# EAGLE design I-GAUGE 5V_Rev2 (EAGLE 6.5.0)
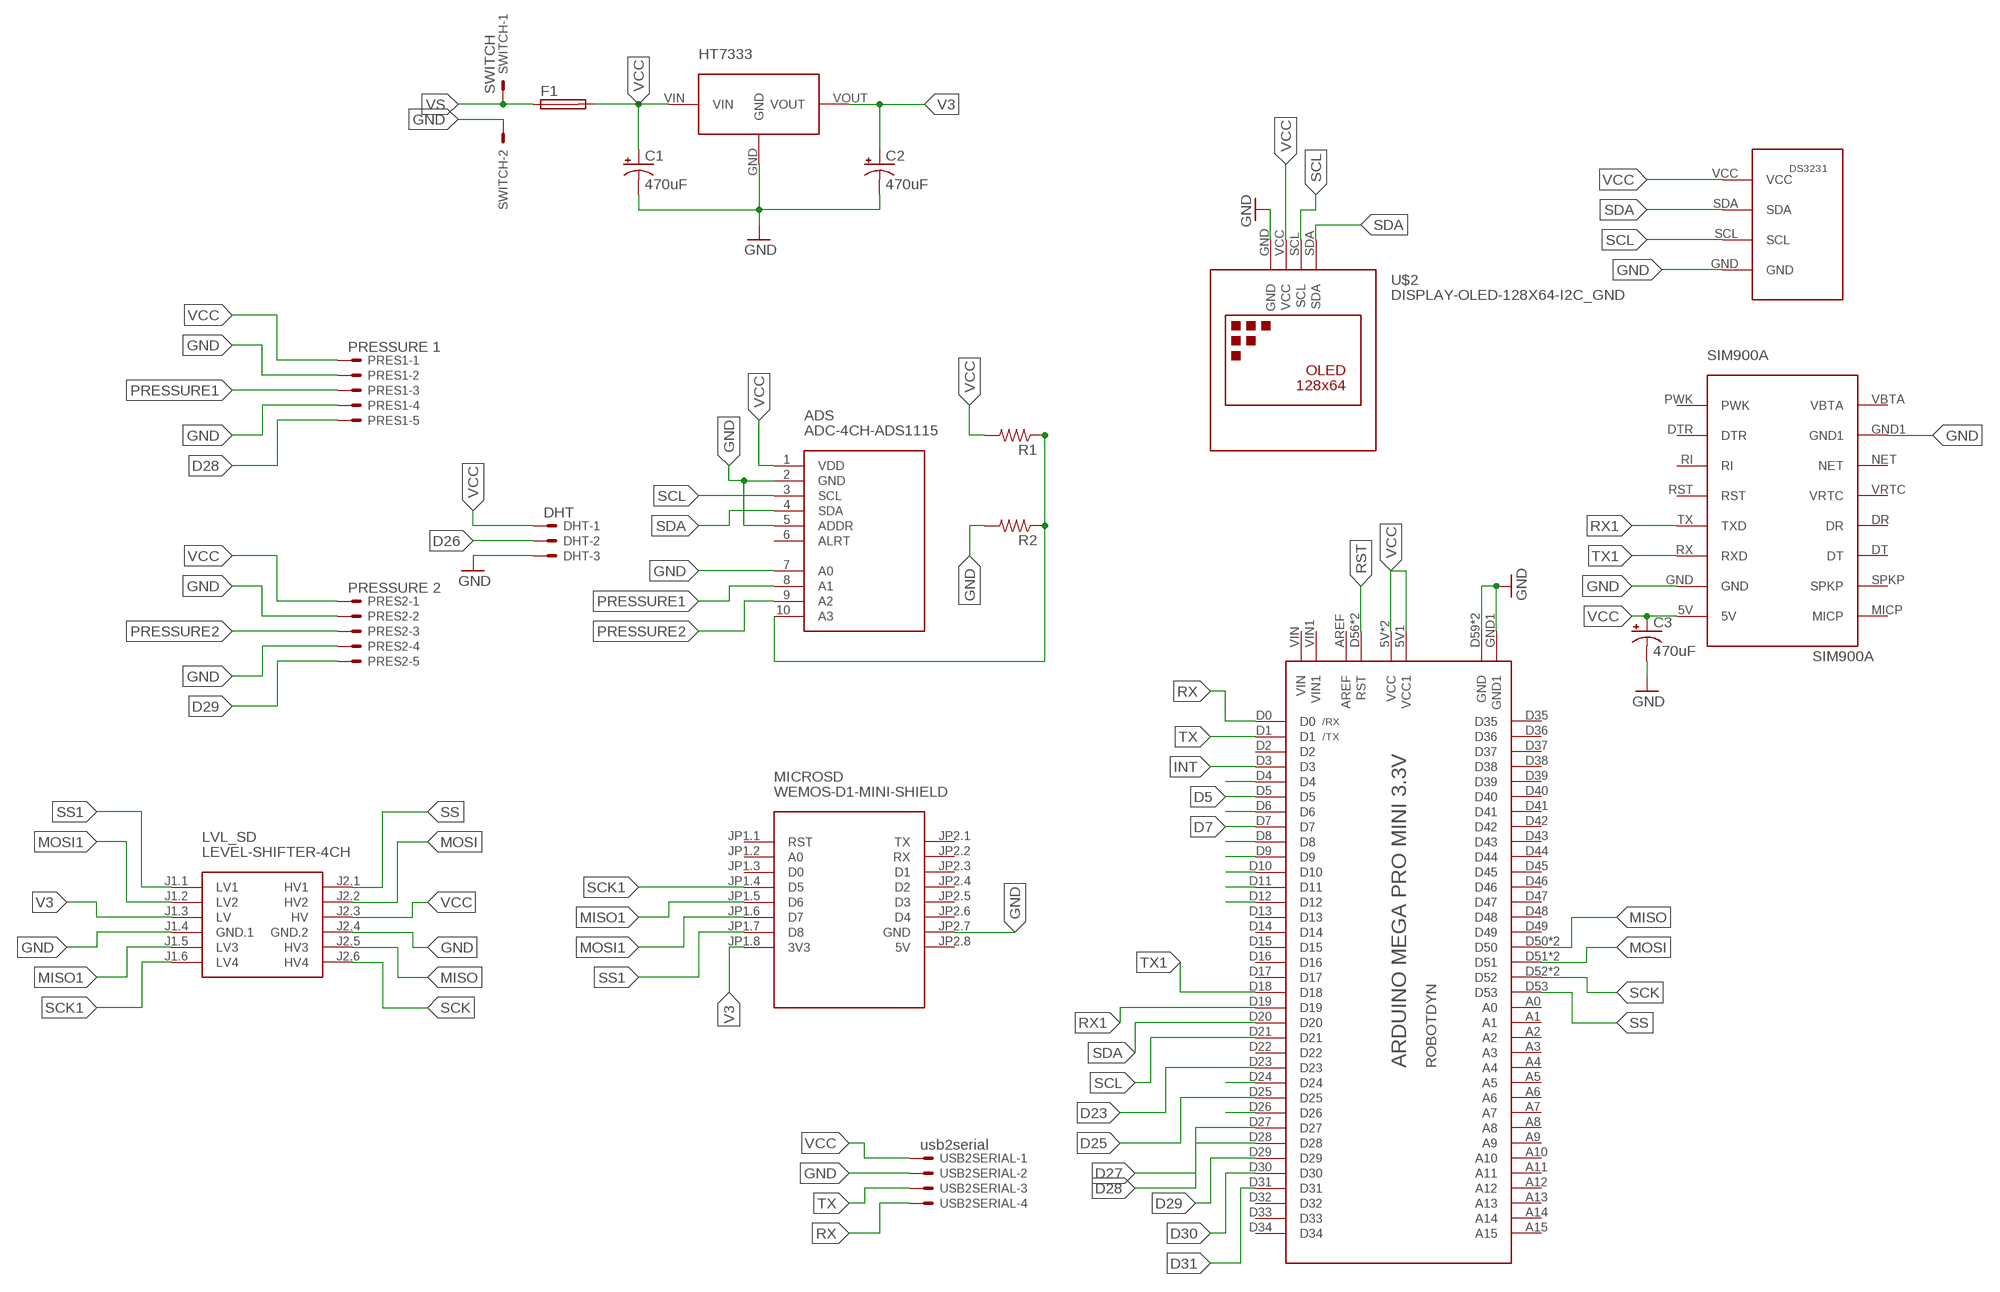
[diagram p0: schematic, sheet 1]

## Parts
ADS  ADC-4CH-ADS1115  [ADC-4CH-ADS1115]
C1  470uF  560UF-PANASONIC_G-25V-20%  [PANASONIC_G]
C2  470uF  560UF-PANASONIC_G-25V-20%  [PANASONIC_G]
C3  470uF  560UF-PANASONIC_G-25V-20%  [PANASONIC_G]
DHT  DHT  JST-XH-03-PIN-ROUND-PAD  [JST-XH-03-PACKAGE-ROUND-PAD]
F1  FUSESH22,5  [SH22,5]
HT7333  HT7333  [SOT89]
LVL_SD  LEVEL-SHIFTER-4CH  [LEVEL-SHIFTER-4CH]
MICROSD  WEMOS-D1-MINI-SHIELD  [WEMOS-D1-MINI-SHIELD]
PRES1  PRESSURE 1  JST-XH-05-PIN-ROUND-PAD  [JST-XH-05-PACKAGE-ROUND-PAD]
PRES2  PRESSURE 2  JST-XH-05-PIN-ROUND-PAD  [JST-XH-05-PACKAGE-ROUND-PAD]
R1  R-US_M1206  [M1206]
R2  R-US_M1206  [M1206]
SWITCH  SWITCH  JST-XH-02-PIN-ROUND-PAD  [JST-XH-02-PACKAGE-ROUND-PAD]
U$1  MEGA-PRO-MINI  [MEGA-PRO-MINI]
U$2  DISPLAY-OLED-128X64-I2C_GND  [DISPLAY-OLED-128X64-I2C_GND]
U$5  DS3231_RASP  [DS3231_RASP]
U$6  SIM900A  [SIM900A]
USB2SERIAL  usb2serial  JST-XH-04-PIN-ROUND-PAD  [JST-XH-04-PACKAGE-ROUND-PAD]

## Nets
D4: U$1.D4
D5: U$1.D5
D6: U$1.D6
D7: U$1.D7
D8: U$1.D8
D9: U$1.D9
D10: U$1.D10
D11: U$1.D11
D12: U$1.D12
D23: U$1.D23
D24: U$1.D24
D25: U$1.D25
D26: DHT.2 U$1.D26
D27: U$1.D27
D28: PRES1.5 U$1.D28
D29: PRES2.5 U$1.D29
D30: U$1.D30
D31: U$1.D31
GND: ADS.2(GND) ADS.5(ADDR) ADS.7(A0) C1.- C2.- C3.- DHT.3 HT7333.GND LVL_SD.J1.4(GND.1) LVL_SD.J2.4(GND.2) MICROSD.JP2.7(GND) PRES1.2 PRES1.4 PRES2.2 PRES2.4 R2.2 SWITCH.2 U$1.D59(GND) U$1.GND U$1.GND1 U$2.GND U$5.GND U$6.GND U$6.GND1 USB2SERIAL.2
INT: U$1.D3
MISO: LVL_SD.J2.5(HV3) U$1.D50 U$1.D54(D50)
MISO1: LVL_SD.J1.5(LV3) MICROSD.JP1.5(D6)
MOSI: LVL_SD.J2.2(HV2) U$1.D51 U$1.D58(D51)
MOSI1: LVL_SD.J1.2(LV2) MICROSD.JP1.6(D7)
PRESSURE1: ADS.8(A1) PRES1.3
PRESSURE2: ADS.9(A2) PRES2.3
RST: U$1.D56(RST) U$1.RST
RX: U$1.D0 USB2SERIAL.4
RX1: U$1.D19 U$6.TX(TXD)
SCK: LVL_SD.J2.6(HV4) U$1.D52 U$1.D55(D52)
SCK1: LVL_SD.J1.6(LV4) MICROSD.JP1.4(D5)
SCL: ADS.3(SCL) U$1.D21 U$2.SCL U$5.SCL
SDA: ADS.4(SDA) U$1.D20 U$2.SDA U$5.SDA
SS: LVL_SD.J2.1(HV1) U$1.D53
SS1: LVL_SD.J1.1(LV1) MICROSD.JP1.7(D8)
TX: U$1.D1 USB2SERIAL.3
TX1: U$1.D18 U$6.RX(RXD)
V3: C2.+ HT7333.VOUT LVL_SD.J1.3(LV) MICROSD.JP1.8(3V3)
VCC: ADS.1(VDD) ADS.10(A3) C1.+ C3.+ DHT.1 F1.2 HT7333.VIN LVL_SD.J2.3(HV) PRES1.1 PRES2.1 R1.1 R1.2 R2.1 U$1.5V1(VCC1) U$1.5V(VCC) U$1.D57(VCC) U$2.VCC U$5.VCC U$6.5V USB2SERIAL.1
VS: F1.1 SWITCH.1
Unconnected: ADS.6(ALRT) MICROSD.JP1.1(RST) MICROSD.JP1.2(A0) MICROSD.JP1.3(D0) MICROSD.JP2.1(TX) MICROSD.JP2.2(RX) MICROSD.JP2.3(D1) MICROSD.JP2.4(D2) MICROSD.JP2.5(D3) MICROSD.JP2.6(D4) U$1.A0 U$1.A1 U$1.A2 U$1.A3 U$1.A4 U$1.A5 U$1.A6 U$1.A7 U$1.A8 U$1.A9 U$1.A10 U$1.A11 U$1.A12 U$1.A13 U$1.A14 U$1.A15 U$1.AREF U$1.D2 U$1.D13 U$1.D14 U$1.D15 U$1.D16 U$1.D17 U$1.D22 U$1.D32 U$1.D33 U$1.D34 U$1.D35 U$1.D36 U$1.D37 U$1.D38 U$1.D39 U$1.D40 U$1.D41 U$1.D42 U$1.D43 U$1.D44 U$1.D45 U$1.D46 U$1.D47 U$1.D48 U$1.D49 U$1.VIN U$1.VIN1 U$6.DR U$6.DT U$6.DTR U$6.MICP U$6.NET U$6.PWK U$6.RI U$6.RST U$6.SPKP U$6.VBTA U$6.VRTC

## Power pins joined to a net without a drawn wire
5V: MICROSD.JP2.8(5V)

## Library data of the parts
ADS = diy-modules:ADC-4CH-ADS1115: 4 Channel 16-Bit Analog-to-Digital Converter based on ADS1115 chip Arduino ADS1115 Getting Started Tutorial is available here: http://henrysbench.capnfatz.com/henrys-bench/arduino-voltage-measurements/arduino-ads1115-module-getting-started-tutorial/ ADS1115 datasheet is available here: http://www.ti.com/lit/ds/symlink/ads1115.pdf Click here to find device on ebay.com <http://www.ebay.com/sch/ads1115+module>
C1-C3 = SparkFun-Capacitors:560UF: 560µF polarized capacitors A capacitor is a passive two-terminal electrical component used to store electrical energy temporarily in an electric field.; PROD_ID: CAP-09983; VALUE: 560uF
DHT = jst XH:JST-XH-03-PIN: JST XH Connector 2 Pin Wire to board connector. Pitch: 2,54 mm, (0.100") Number of pins: 3 Created by Rembrandt Electronics www.rembrandtelectronics.com
F1 = fuse:FUSE: Fuse; OC_FARNELL: unknown; OC_NEWARK: unknown
HT7333 = HT7333_SOT89:HT7333
LVL_SD = diy-modules:LEVEL-SHIFTER-4CH: 4-Channel Bi-Directional Logic Level Converter based on BSS128 transistors Click here to find device on ebay.com <http://www.ebay.com/sch/i2c+logic+converter+module>
MICROSD = diy-modules:WEMOS-D1-MINI-SHIELD: Template for WEMOS D1 mini compatible shields NOTICE: This is a template only. You can use it as a base to create symbols for WEMOS D1 mini compatible shields. Official list of available shields can be found here: https://www.wemos.cc/D1-mini-Shields
PRES1 PRES2 = jst XH:JST-XH-05-PIN: JST XH Connector 2 Pin Wire to board connector. Pitch: 2,54 mm, (0.100") Number of pins: 5 Created by Rembrandt Electronics www.rembrandtelectronics.com
R1 R2 = resistor:R-US_: RESISTOR, American symbol
SWITCH = jst XH:JST-XH-02-PIN: JST XH Connector 2 Pin Wire to board connector. Pitch: 2,54 mm, (0.100") Number of pins: 2 Created by Rembrandt Electronics www.rembrandtelectronics.com
U$1 = robotdyn-arduino mega 3.3v:MEGA-PRO-MINI
U$2 = diy-modules:DISPLAY-OLED-128X64-I2C_GND: 128x64 Dot Matrix OLED Module based on SSD1306 chip Variant with I2C interface More details available here: http://www.instructables.com/id/Monochrome-096-i2c-OLED-display-with-arduino-SSD13/ SSD1306 datasheet: https://cdn-shop.adafruit.com/datasheets/SSD1306.pdf Click here to find device on ebay.com <http://www.ebay.com/sch/oled+display+128x64+iic> Note: There are two variants: I2C and SPI. Search for the proper version.
U$5 = ds3231_rasp:DS3231_RASP
U$6 = SIM900A GSM MODULE:SIM900A
USB2SERIAL = jst XH:JST-XH-04-PIN: JST XH Connector 2 Pin Wire to board connector. Pitch: 2,54 mm, (0.100") Number of pins: 4 Created by Rembrandt Electronics www.rembrandtelectronics.com

## Board
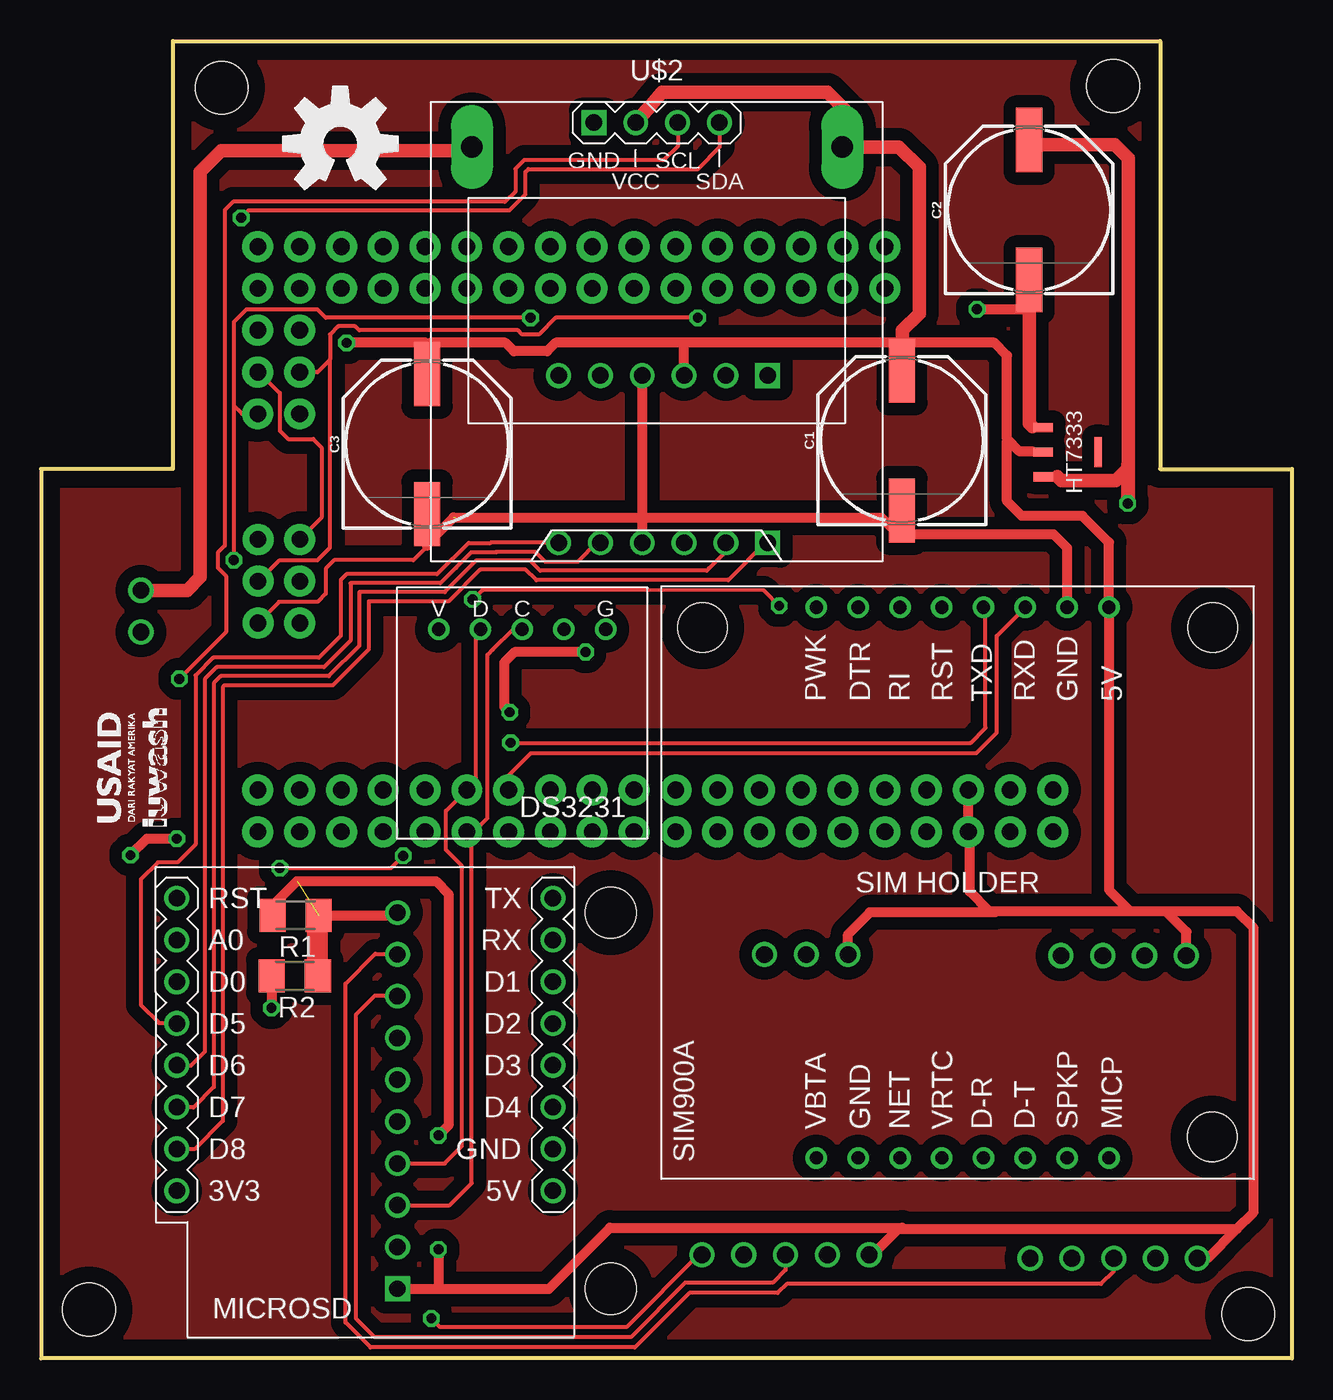
[diagram p1: board, top side]
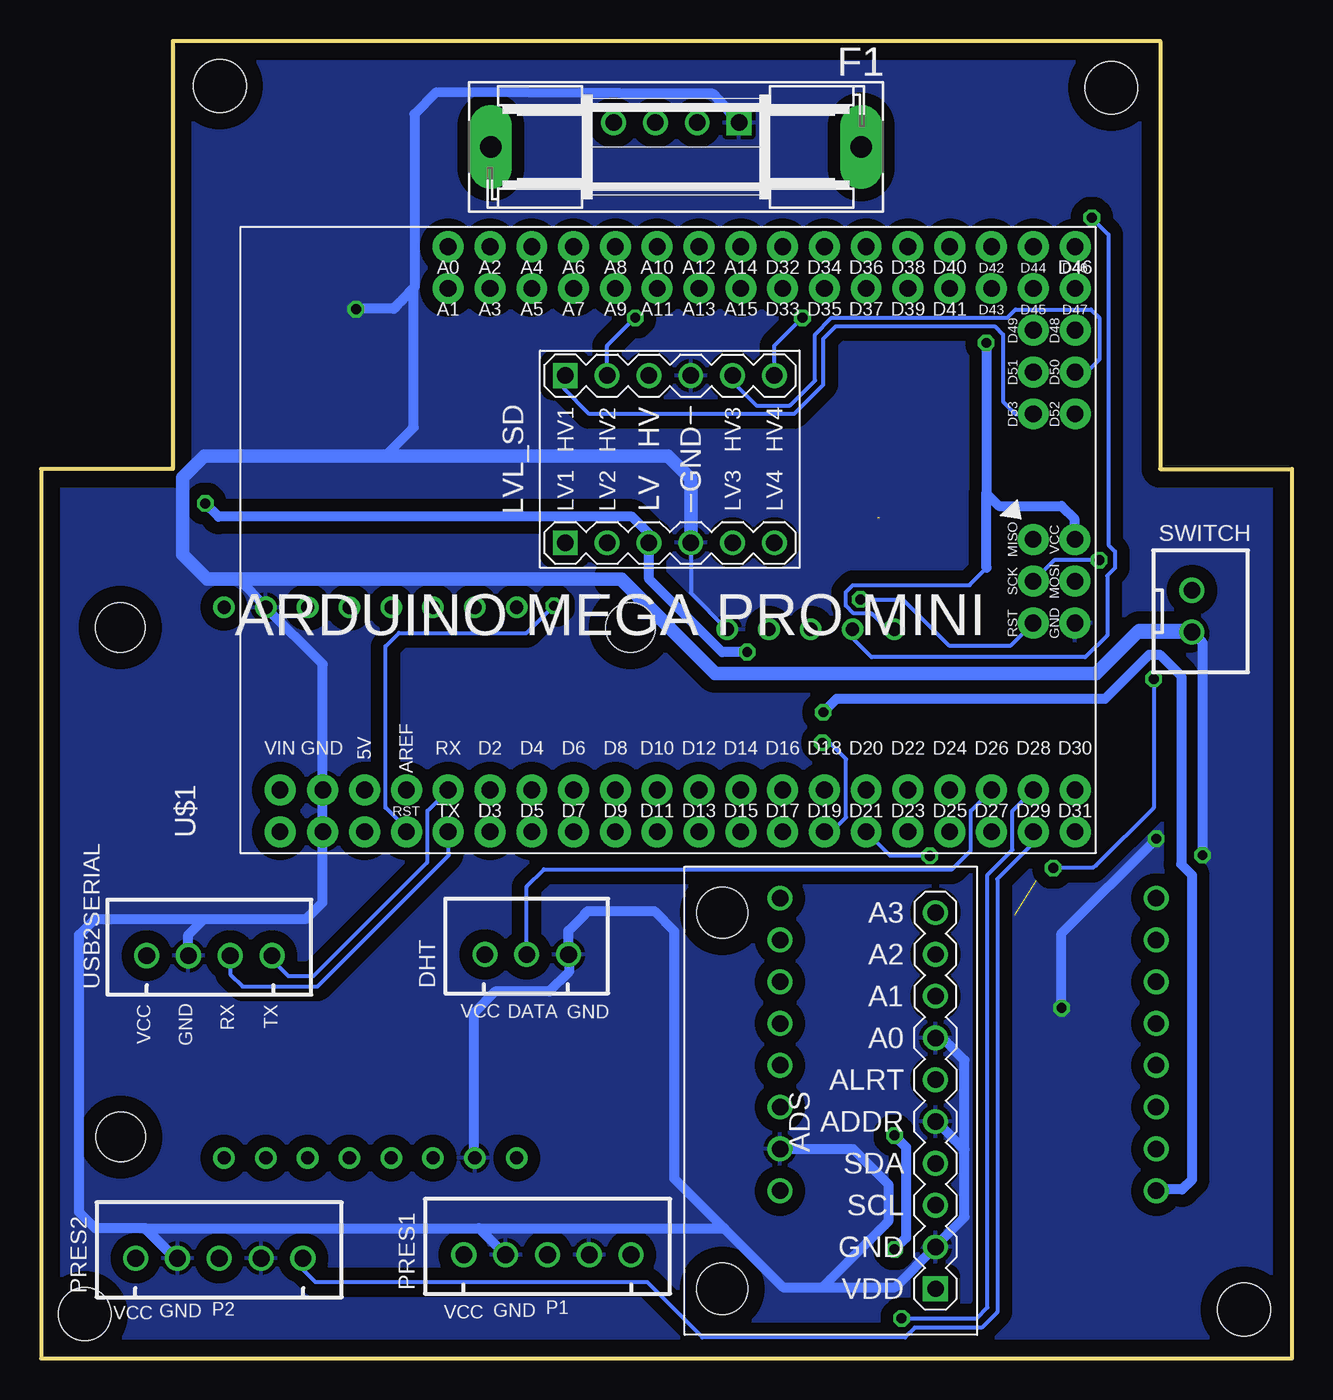
[diagram p2: board, bottom side, seen from below]

Size 76 x 80.04 mm. Coordinates in mm from the lower left corner, seen from the top.
Outline: 8,80.04 68,80.04 68,54.04 76,54.04 76,0 0,0 0,54.04 8,54.04 8,80.04
Copper layers (1*16): Top 0.035mm / dielectric 1.5mm / Bottom 0.035mm
Design rules "default *": minimum track width 10mil, minimum drill 24mil, track to track 30mil, track to pad 30mil, pad to pad 30mil, via to via 30mil, smd to smd 30mil, copper to edge 40mil, drill to drill 8mil, minimum pad ring 10mil, minimum via ring 8mil, stop-mask expansion 4mil, vias tented up to drill 0mil, thermal gap 10mil
Holes 3.2 mm at 10.97,77.21 65.14,77.31 2.91,2.96 73.35,2.69

### Footprints (pad centres in the part's own frame; a part is rotated, then mirrored left to right if it is on the bottom)
ADC-4CH-ADS1115 = drill 1 square: 1 -6.35,11.43 | drill 1: 2 -6.35,8.89; 3 -6.35,6.35; 4 -6.35,3.81; 5 -6.35,1.27; 6 -6.35,-1.27; 7 -6.35,-3.81; 8 -6.35,-6.35; 9 -6.35,-8.89; 10 -6.35,-11.43 | hole 3.1: 6.604,11.43; 6.604,-11.43
PANASONIC_G = smd 3.9 x 1.6: + 4.25,0; - -4.25,0
JST-XH-03-PACKAGE-ROUND-PAD = drill 1.016: 1 -2.54,0; 2 0,0; 3 2.54,0
SH22,5 = drill 1.321 pad 2.54 long: 1 -11.252,0; 2 11.252,0
SOT89 = smd 0.559 x 1.194: GND -1.499,-0.597; VIN 0,-0.597; VOUT 1.499,-0.597 | smd 1.829 x 0.457: P$4 0,2.743
LEVEL-SHIFTER-4CH = drill 1 square: J1.1 -5.08,6.35; J2.1 5.08,6.35 | drill 1: J1.2 -5.08,3.81; J1.3 -5.08,1.27; J1.4 -5.08,-1.27; J1.5 -5.08,-3.81; J1.6 -5.08,-6.35; J2.2 5.08,3.81; J2.3 5.08,1.27; J2.4 5.08,-1.27; J2.5 5.08,-3.81; J2.6 5.08,-6.35
WEMOS-D1-MINI-SHIELD = drill 1: JP1.1 -11.43,12.065; JP1.2 -11.43,9.525; JP1.3 -11.43,6.985; JP1.4 -11.43,4.445; JP1.5 -11.43,1.905; JP1.6 -11.43,-0.635; JP1.7 -11.43,-3.175; JP1.8 -11.43,-5.715; JP2.1 11.43,12.065; JP2.2 11.43,9.525; JP2.3 11.43,6.985; JP2.4 11.43,4.445; JP2.5 11.43,1.905; JP2.6 11.43,-0.635; JP2.7 11.43,-3.175; JP2.8 11.43,-5.715
JST-XH-05-PACKAGE-ROUND-PAD = drill 1.016: 1 -5.08,0; 2 -2.54,0; 3 0,0; 4 2.54,0; 5 5.08,0
M1206 = smd 1.6 x 2: 1 -1.4,0; 2 1.4,0
JST-XH-02-PACKAGE-ROUND-PAD = drill 1.016: 1 -1.27,0; 2 1.27,0
MEGA-PRO-MINI = drill 1.016 pad 1.88: 5V 3.81,44.45; 5V1 1.27,44.45; A0 36.83,39.37; A1 34.29,39.37; A2 36.83,36.83; A3 34.29,36.83; A4 36.83,34.29; A5 34.29,34.29; A6 36.83,31.75; A7 34.29,31.75; A8 36.83,29.21; A9 34.29,29.21; A10 36.83,26.67; A11 34.29,26.67; A12 36.83,24.13; A13 34.29,24.13; A14 36.83,21.59; A15 34.29,21.59; AREF 3.81,41.91; D0 3.81,39.37; D1 1.27,39.37; D2 3.81,36.83; D3 1.27,36.83; D4 3.81,34.29; D5 1.27,34.29; D6 3.81,31.75; D7 1.27,31.75; D8 3.81,29.21; D9 1.27,29.21; D10 3.81,26.67; D11 1.27,26.67; D12 3.81,24.13; D13 1.27,24.13; D14 3.81,21.59; D15 1.27,21.59; D16 3.81,19.05; D17 1.27,19.05; D18 3.81,16.51; D19 1.27,16.51; D20 3.81,13.97; D21 1.27,13.97; D22 3.81,11.43; D23 1.27,11.43; D24 3.81,8.89; D25 1.27,8.89; D26 3.81,6.35; D27 1.27,6.35; D28 3.81,3.81; D29 1.27,3.81; D30 3.81,1.27; D31 1.27,1.27; D32 36.83,19.05; D33 34.29,19.05; D34 36.83,16.51; D35 34.29,16.51; D36 36.83,13.97; D37 34.29,13.97; D38 36.83,11.43; D39 34.29,11.43; D40 36.83,8.89; D41 34.29,8.89; D42 36.83,6.35; D43 34.29,6.35; D44 36.83,3.81; D45 34.29,3.81; D46 36.83,1.27; D47 34.29,1.27; D48 31.75,1.27; D49 31.75,3.81; D50 29.21,1.27; D51 29.21,3.81; D52 26.67,1.27; D53 26.67,3.81; D54 19.04,3.82; D55 16.5,3.82; D56 13.96,3.82; D57 19.04,1.28; D58 16.5,1.28; D59 13.96,1.28; GND 3.81,46.99; GND1 1.27,46.99; RST 1.27,41.91; VIN 3.81,49.59; VIN1 1.27,49.59
DISPLAY-OLED-128X64-I2C_GND = drill 1 square: GND -3.81,12.7 | drill 1: SCL 1.27,12.7; SDA 3.81,12.7; VCC -1.27,12.7
DS3231_RASP = drill 0.8: GND 2.54,2.54; NC 5.08,2.54; SCL 7.62,2.54; SDA 10.16,2.54; VCC 12.7,2.54
SIM900A = drill 0.8: 5V 34.73,8.81; DR 1.27,16.43; DT 1.27,13.89; DTR 34.73,24.05; GND 34.73,11.35; GND1 1.27,24.05; MICP 1.27,8.81; NET 1.27,21.51; PWK 34.73,26.59; RI 34.73,21.51; RST 34.73,18.97; RX 34.73,13.89; SPKP 1.27,11.35; TX 34.73,16.43; VBTA 1.27,26.59; VRTC 1.27,18.97 | hole 3: 2.54,2.54; 33.5,33.5; 33.5,2.5
JST-XH-04-PACKAGE-ROUND-PAD = drill 1.016: 1 -3.81,0; 2 -1.27,0; 3 1.27,0; 4 3.81,0

### Placement (x,y rotation side)
ADS  28.01,15.66 180 bottom
C1  52.31,55.77 90 top
C2  60.04,69.79 90 top
C3  23.45,55.56 90 top
DHT  46.49,24.54 0 bottom
F1  37.43,73.61 180 bottom
HT7333  61.49,55.06 270 top
LVL_SD  37.8,54.64 90 bottom
MICROSD  19.67,15.9 0 top
PRES1  45.23,6.29 0 bottom
PRES2  65.18,6.08 0 bottom
R1  15.47,26.92 180 top
R2  15.41,23.24 180 top
SWITCH  6.07,45.4 270 bottom
U$1  11.9,30.72 90 bottom
U$2  37.4,62.39 0 top
U$4  [OSHW-LOGO-L]  18.18,73.81 0 top
U$5  36.85,46.84 180 top
U$6  73.7,10.91 90 top
USB2SERIAL  65.78,24.47 0 bottom

### Tracks (layer width: path | path; a pad name or v marks a point on that pad's centre or on a via)
D26
  Bottom 0.254: DHT.2 46.49,28.67 45.45,29.71 20.65,29.71 19.59,30.78 19.58,30.78 19.52,30.84 19.52,33.26 U$1.D26
D28  (via drill 0.6)
  Top 0.254: PRES1.5 39.96,6.29 35.56,1.9 24.25,1.9 v23.71,2.43
  Bottom 0.254: v23.71,2.43 19.15,2.43 18.49,3.09 18.49,29.39 17.07,30.81 17.07,30.82 17.03,30.86 17.02,30.86 16.97,30.9 16.97,33.27 U$1.D28
D29
  Bottom 0.254: U$1.D29 15.71,31.33 17.83,29.21 17.83,29.2 17.9,29.13 17.9,2.8 18.84,1.87 22.91,1.87 23.5,1.28 35.81,1.28 39.16,4.62 59.33,4.62 60.2,5.5 60.2,5.98 PRES2.5
GND  (via drill 0.6)  (1 unrouted)
  Top 0.254: C3.- 23.45,49.36 23.45,49.32 22.63,48.5 17.8,48.5 17.29,47.99 17.29,46.47 16.79,45.96 14.45,45.96 U$1.D59 | 36.51,50.22 36.51,49.58 LVL_SD.J1.4 | 51.82,49.89 52.28,49.89 52.39,50 52.39,51.44 C1.-
  Top 0.305: 60.22,56.63 60.83,56.63 HT7333.GND
  Top 0.61: v56.87,63.75 59.8,63.75 60.04,63.99 | 52.39,51.44 52.39,50.09 61.52,50.09 62.34,49.26 U$6.GND | LVL_SD.J2.4 LVL_SD.J1.4 | 23.45,49.36 23.45,49.49 25.05,51.1 | 25.18,51.09 51.07,51.09 52.28,49.89 | R2.2 14.01,21.31 v13.99,21.29 | v8.25,31.58 6.42,31.58 v5.42,30.58
  Top 0.813: C2.- 60.04,63.99 60.04,56.81 60.22,56.63
  Bottom 0.254: 66.19,26.6 59.81,26.6 58.91,27.5 58.91,27.69 | LVL_SD.J1.4 36.52,46.51 U$5.GND
  Bottom 0.61: U$2.GND 34.26,75.84 35.16,76.85 51.99,76.92 53.31,75.61 53.31,65.07 53.36,65.02 | 53.36,65.02 54.01,64.37 | 54.01,64.37 | 54.01,64.37 54.36,64.02 54.36,63.99 54.56,63.78 56.84,63.78 v56.87,63.75 | 66.11,54.83 55.09,54.83 53.46,56.45 53.46,56.48 53.36,56.58 53.36,65.02 | 64,47.35 62.35,45.69 U$6.GND 58.89,42.18 U$1.GND U$1.GND1 58.91,31.97 58.91,27.69 59.88,26.72 72.72,26.72 73.7,25.74 73.7,8.88 72.72,7.91 69.71,7.91 67.89,6.08 PRES2.2 67.84,6.08 69.66,7.9 49.4,7.9 | USB2SERIAL.2 67.05,25.74 66.19,26.6 | 49.4,7.9 34.5,7.9 | 34.5,7.9 30.92,4.32 28.51,4.32 | 28.51,4.32 24.1,4.32 ADS.2 21.66,6.81 19.89,8.58 19.89,12.68 | 19.89,12.68 19.89,18.12 21.14,19.37 21.56,19.37 ADS.7 | ADS.5 21.59,14.39 19.89,12.68 | MICROSD.JP2.7 26.66,12.73 24.52,10.58 24.52,8.31 28.51,4.32 | PRES1.2 47.78,6.29 49.4,7.9 | 34.5,7.9 37.54,10.94 37.54,25.97 38.74,27.18 42.78,27.18 43,26.96 43,26.93 43.95,25.97 DHT.3 43.9,24.49 43.9,23.51 45.13,22.28 48.4,22.28 49.71,20.98 49.71,12.24 U$6.GND1 | v13.99,21.29 13.99,25.83 v8.25,31.58 | v5.42,30.58 5.42,43.49 SWITCH.2
  Bottom 0.813: LVL_SD.J1.4 36.52,53.44 37.91,54.83 66.11,54.83 67.4,53.53 67.4,48.85 65.91,47.35 64,47.35 41.27,47.35 41.26,47.35 40.75,47.35 35.03,41.63 11.91,41.63 9.4,44.13 SWITCH.2
  pour Bottom: 68,80.02 68,54.04 76,54.04 76,0 0.01,0 0.01,54.05 8.01,54.05 8.01,80.04 8,80.04 7.99,80.04 8.01,80.05
MISO
  Top 0.254: U$1.D50 13.22,59.93 14.5,58.66 14.5,56.37 15.01,55.86 16.53,55.86 17.04,55.36 17.04,51.09 U$1.D54
  Bottom 0.254: LVL_SD.J2.5 33.98,59.35 32.53,57.9 30.5,57.9 28.98,59.42 28.98,62.21 27.96,63.23 17.29,63.23 16.79,63.74 12.21,63.74 11.71,63.23 11.71,60.69 12.47,59.93 U$1.D50
MISO1
  Top 0.254: LVL_SD.J1.5 33.76,49.56 32.6,48.4 30.64,48.4 30.04,49 27.65,49 27.64,48.99 26.16,48.99 25.22,48.05 25.21,48.05 24.27,47.11 18.8,47.11 18.8,47.1 18.8,43.61 17.18,42 10.68,42 9.95,41.27 9.95,18.64 9.09,17.78 8.27,17.78 MICROSD.JP1.5
MOSI  (via drill 0.6)
  Top 0.254: 17.55,60.69 17.55,62.21 18.06,62.72 19.07,62.72 19.33,62.47 28.98,62.47 29.23,62.21 30.25,62.21 31.26,63.23 v39.9,63.23 | 17.55,60.69 16.79,59.93 U$1.D51 | U$1.D58 13.23,47.22 14.5,48.5 16.79,48.5 17.55,49.26 17.55,60.69
  Bottom 0.254: LVL_SD.J2.2 41.6,61.53 v39.9,63.23
MOSI1
  Top 0.254: LVL_SD.J1.2 41.6,49.03 40.58,48 40.58,47.99 40.45,47.86 30.33,47.86 29.71,48.47 26.43,48.47 24.52,46.56 19.34,46.56 | 19.34,46.56 | 19.34,46.56 19.34,43.3 17.48,41.45 10.91,41.45 10.5,41.03 10.5,16.49 9.26,15.25 8.26,15.25 MICROSD.JP1.6
N$1
  pour Top: 8.02,80.03 68.02,80.03 68.02,54.03 76.01,54.03 76.01,-0.01 0,-0.01 0,54.03 8,54.03 8,80.02
N$2
  Bottom 0.813: 41.28,47.36 40.79,47.36 35.04,41.61 11.89,41.61 9.27,44.22 6.35,44.22 6.18,44.05
PRESSURE1
  Top 0.254: PRES1.3 45.23,5.37 44.46,4.6 39.14,4.6 35.83,1.3 20.25,1.3 19.15,2.39 19.15,20.91 20.29,22.04 21.62,22.04 ADS.8
PRESSURE2
  Top 0.254: PRES2.3 65.18,5.3 64.41,4.53 45.31,4.53 44.76,3.98 39.38,3.98 36.08,0.67 20.01,0.67 18.49,2.18 18.49,22.77 20.3,24.58 21.63,24.58 ADS.9
RST  (via drill 0.6)
  Top 0.254: v44.85,45.73 v44.84,45.73 44,46.57 | 44,46.57 | 44,46.57 43.91,46.67 26.83,46.69 v26.22,46.12
  Bottom 0.254: U$1.RST 53.81,32.19 55.08,33.46 55.08,43.26 54.25,44.09 46.49,44.09 v44.85,45.73 | v26.22,46.12 23.64,46.12 20.84,43.33 17.07,43.33 U$1.D56
RX
  Bottom 0.254: USB2SERIAL.4 61.97,24.21 60.99,23.23 59.46,23.23 52.58,30.11 52.57,30.11 52.53,30.15 52.53,33.27 U$1.D0
RX1  (via drill 0.6)
  Top 0.254: v28.52,37.41 56.49,37.41 57.39,38.31 57.39,45.51 U$6.TX
  Bottom 0.254: U$1.D19 27.97,31.99 27.09,32.87 27.09,36.41 28.11,37.43 28.51,37.43 v28.52,37.41
SCK  (via drill 0.6)
  Top 0.254: v29.74,63.23 17.29,63.23 16.79,63.74 12.47,63.74 11.71,62.98 11.71,57.9 | 12.21,57.39 U$1.D52 12.21,57.39 | 12.21,57.39 11.71,57.9 | 11.71,57.9 v11.71,48.5
  Bottom 0.254: LVL_SD.J2.6 31.45,61.53 v29.74,63.23 | v11.71,48.5 14.44,48.5 U$1.D55
SCK1
  Top 0.254: LVL_SD.J1.6 27.32,49.56 27.31,49.56 25.98,49.56 25.02,48.6 25,48.6 24.06,47.65 18.55,47.65 18.21,47.31 18.21,43.89 16.89,42.57 10.47,42.57 9.38,41.49 9.38,31.23 8.29,30.14 7.1,30.14 6.06,29.1 6.06,21.49 7.17,20.38 8.21,20.38 MICROSD.JP1.4
SCL  (via drill 0.6)
  Top 0.254: U$5.SCL 28.68,44.3 27.44,43.06 | 27.44,43.06 | 27.44,43.06 27.12,42.74 27.12,32.83 26.28,31.99 | U$1.D21 26.28,31.99 | ADS.3 24.82,9.31 26.16,10.65 26.16,31.88 26.28,31.99 | v8.4,41.29 8.83,41.72 8.87,41.75 8.87,41.77 11.24,44.14 11.24,47.55 10.74,48.05 10.74,48.96 11.17,49.39 11.17,69.77 11.67,70.27 28.19,70.27 28.82,70.9 28.82,72.28 29.36,72.82 37.85,72.82 38.72,73.69 38.72,75.04 U$2.SCL | v14.5,29.8 21.26,29.8 v22,30.54
  Bottom 0.254: v8.4,41.29 8.4,33.45 11.9,29.94 12.11,29.81 v14.5,29.8 | v22,30.54 24.41,30.54 U$1.D21
SDA  (via drill 0.6)
  Top 0.254: ADS.4 24.52,11.85 25.58,12.91 25.58,29.92 24.6,30.9 24.6,33.26 U$1.D20 25.87,34.59 26.41,35.14 26.41,44.02 U$5.SDA | v12.15,69.31 12.21,69.37 12.58,69.74 28.44,69.74 29.41,70.71 29.41,72.06 29.43,72.08 29.43,72.09 29.45,72.11 29.45,72.12 29.61,72.27 39.9,72.27 41.24,73.62 41.24,75.06 U$2.SDA
  Bottom 0.254: v12.15,69.31 12.15,69.3 11.15,68.29 11.15,49.43 10.75,49.04 10.75,48.03 11.22,47.56 11.22,43.94 12.56,42.6 25.53,42.6 26.69,43.76 U$5.SDA
SS
  Bottom 0.254: U$1.D53 16.79,57.39 17.55,58.15 17.55,62.21 18.06,62.72 27.71,62.72 28.47,61.96 28.47,59.17 30.25,57.39 42.69,57.39 44.22,58.91 44.22,59.65 LVL_SD.J2.1
SS1
  Top 0.254: LVL_SD.J1.1 44.03,49.56 41.8,47.33 41.79,47.33 41.74,47.28 30.1,47.28 29.45,47.93 26.69,47.93 24.75,45.99 19.92,45.99 19.91,46 19.91,43.09 17.71,40.89 11.14,40.89 11.04,40.79 11.04,14.42 9.33,12.71 8.26,12.71 MICROSD.JP1.7
TX
  Bottom 0.254: USB2SERIAL.3 64.51,23.34 63.77,22.6 59.2,22.6 51.24,30.56 51.24,31.97 U$1.D1
TX1
  Top 0.254: U$1.D18 28.41,35.42 29.76,36.77 56.83,36.77 58.07,38.02 58.07,43.9 U$6.RX
V3  (via drill 0.6)
  Top 0.305: 61.74,53.58 60.91,53.58 HT7333.VOUT
  Top 0.61: v33.09,42.92 28.78,42.92 28.13,42.27 28.13,39.59 v28.47,39.26
  Top 0.813: 61.74,53.58 62,53.32 65.3,53.32 66.06,54.09 66.06,54.36 66.02,54.32 v66.02,51.95 66.06,51.98 66.06,72.92 65.25,73.73 59.91,73.73 60.03,73.61 60.03,73.45 60.08,73.49 60.11,73.49 60.06,73.45 60.06,73.4 60.13,73.47 60.13,73.73 60.04,73.83 C2.+
  Bottom 0.254: 40.03,51.09 40.09,51.15
  Bottom 0.61: 40.03,51.09 39.06,50.12 LVL_SD.J1.3 39.05,49.55 39.05,47.35 34.63,42.92 v33.09,42.92 | 40.09,51.15 65.22,51.15 v66.02,51.95 | v28.47,39.26 28.47,39.28 27.65,40.09 11.34,40.09 8.67,42.76 8.04,42.76 6.72,41.45 6.72,30.01 6.08,29.37 6.08,10.86 6.68,10.26 8.17,10.26 MICROSD.JP1.8
VCC  (via drill 0.6)  (1 unrouted)
  Top 0.254: U$5.VCC 24.16,44.3 v24.17,44.31
  Top 0.305: HT7333.VIN 60.26,55.06 60.22,55.1
  Top 0.61: 60.22,55.1 59.46,55.1 58.74,55.82 | 58.74,55.82 58.7,55.86 58.7,60.94 57.93,61.71 52.6,61.71 52.35,61.45 | C1.+ 52.31,61.49 52.09,61.71 39.14,61.71 | v18.56,61.71 23.39,61.71 23.45,61.65 C3.+ 23.64,60.01 23.64,61.71 28.22,61.71 28.72,61.2 30.76,61.2 31.26,61.71 39.14,61.71 | LVL_SD.J2.3 39.06,61.63 39.14,61.71 | PRES1.1 50.52,6.29 52.09,7.86 52.39,7.86 | 52.39,7.86 72.67,7.86 | 72.67,7.86 73.68,8.87 73.68,26.15 72.67,27.16 68.35,27.16 | USB2SERIAL.1 69.59,25.92 68.35,27.16 | 68.35,27.16 66.2,27.16 | 66.2,27.16 58,27.16 | 58,27.16 57.63,27.16 56.43,28.36 56.43,31.91 U$1.5V1 U$1.5V | 66.2,27.16 64.89,28.48 U$6.5V 64.89,49.57 63.27,51.19 59.59,51.19 58.69,52.08 58.69,55.77 58.74,55.82 | ADS.1 24.2,4.23 | 24.2,4.23 30.86,4.23 34.57,7.93 52.32,7.93 52.39,7.86 | DHT.1 49.03,25.77 50.36,27.09 50.36,27.1 50.38,27.12 57.96,27.12 58,27.16 | PRES2.1 70.89,6.08 72.67,7.86 | R1.2 14.06,27.51 15.55,29 23.99,29 24.75,28.23 24.75,14.15 v24.14,13.54 | v24.14,6.62 24.14,4.29 24.2,4.23 | R1.1 21.49,26.92 ADS.10
  Top 0.813: C1.+ 52.35,60.06 52.35,61.45 52.35,62.47 53.36,63.48 53.36,72.37 52.13,73.61 F1.2 48.79,73.72 48.79,75.93 47.77,76.95 37.73,76.95 37.06,76.15 U$2.VCC
  Top 1.27: R2.1 16.81,26.86 R1.1
  Bottom 0.254: v24.17,44.31 24.59,44.31 25.47,45.18 25.51,45.23 25.52,45.23 25.55,45.26 26.63,45.26 27.1,45.74 27.1,46.56 26.68,46.99 19.59,46.99 18.65,47.93 18.65,47.94 18.55,48.03
  Bottom 0.61: v18.56,61.71 18.56,52.56 18.55,52.55 | 18.55,52.55 17.8,51.8 13.99,51.8 13.23,51.04 13.23,49.82 U$1.D57 | 18.55,48.03 18.55,52.55 | v24.14,13.54 v24.13,13.54 23.6,13.02 23.6,13 23.45,12.85 23.45,7.31 v24.14,6.62
VS
  Top 0.813: SWITCH.1 8.86,46.67 9.67,47.48 9.67,72.12 10.94,73.39 25.96,73.39 F1.1

### Text on the board
bNames: GND | GND | DATA | VCC | TX | RX | VCC | P1 | P2 | GND | VCC | GND | VCC